# EAGLE schematic flex_sensor_wheatstone (EAGLE 9.3.1)

## Sheet 1 of 2
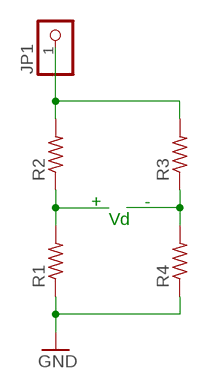
[diagram p0: schematic, sheet 1]

### Parts
JP1  PINHD-1X1  [1X01]
R1  R-US_0207/5V  [0207/5V]
R2  R-US_0207/5V  [0207/5V]
R3  R-US_0207/7  [0207/7]
R4  R-US_0207/7  [0207/7]

### Nets
GND: R1.1 R4.1
N$2: R1.2 R2.1
N$3: R3.1 R4.2
N$4: JP1.1 R2.2 R3.2

### Notes on the sheet
- + | -
- Vd

## Sheet 2 of 2

## Library data of the parts
JP1 = pinhead:PINHD-1X1: PIN HEADER
R1-R4 = rcl:R-US_: RESISTOR, American symbol; SPICEPREFIX: R